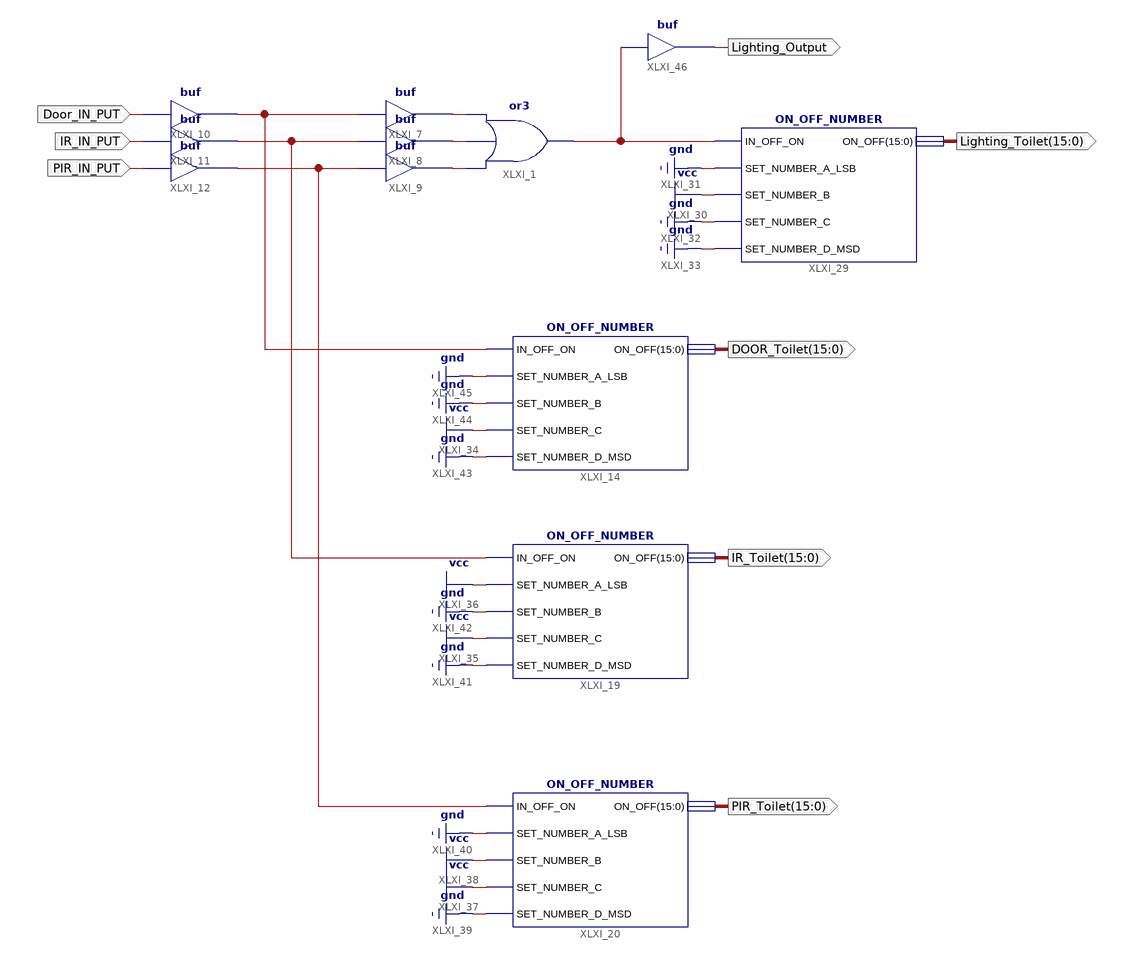
[diagram p0: schematic sheet 1]
// Xilinx ISE schematic Toilet.sch (spartan6) as structural Verilog: 12 symbols, 8 ports
module Toilet (
  input  Door_IN_PUT,
  input  IR_IN_PUT,
  input  PIR_IN_PUT,
  output [15:0] DOOR_Toilet,
  output [15:0] Lighting_Toilet,
  output [15:0] IR_Toilet,
  output [15:0] PIR_Toilet,
  output Lighting_Output
);

  wire XLXN_5, XLXN_6, XLXN_7, XLXN_8, XLXN_15, XLXN_16, XLXN_25;

  or XLXI_1 (XLXN_25, XLXN_7, XLXN_6, XLXN_5);
  buf XLXI_7 (XLXN_5, XLXN_8);
  buf XLXI_8 (XLXN_6, XLXN_15);
  buf XLXI_9 (XLXN_7, XLXN_16);
  buf XLXI_10 (XLXN_8, Door_IN_PUT);
  buf XLXI_11 (XLXN_15, IR_IN_PUT);
  buf XLXI_12 (XLXN_16, PIR_IN_PUT);
  ON_OFF_NUMBER XLXI_14 (
    .IN_OFF_ON(XLXN_8), .SET_NUMBER_A_LSB(1'b0), .SET_NUMBER_B(1'b0), .SET_NUMBER_C(1'b1),
    .SET_NUMBER_D_MSD(1'b0), .ON_OFF(DOOR_Toilet));
  ON_OFF_NUMBER XLXI_19 (
    .IN_OFF_ON(XLXN_15), .SET_NUMBER_A_LSB(1'b1), .SET_NUMBER_B(1'b0), .SET_NUMBER_C(1'b1),
    .SET_NUMBER_D_MSD(1'b0), .ON_OFF(IR_Toilet));
  ON_OFF_NUMBER XLXI_20 (
    .IN_OFF_ON(XLXN_16), .SET_NUMBER_A_LSB(1'b0), .SET_NUMBER_B(1'b1), .SET_NUMBER_C(1'b1),
    .SET_NUMBER_D_MSD(1'b0), .ON_OFF(PIR_Toilet));
  ON_OFF_NUMBER XLXI_29 (
    .IN_OFF_ON(XLXN_25), .SET_NUMBER_A_LSB(1'b0), .SET_NUMBER_B(1'b1), .SET_NUMBER_C(1'b0),
    .SET_NUMBER_D_MSD(1'b0), .ON_OFF(Lighting_Toilet));
  buf XLXI_46 (Lighting_Output, XLXN_25);
endmodule
